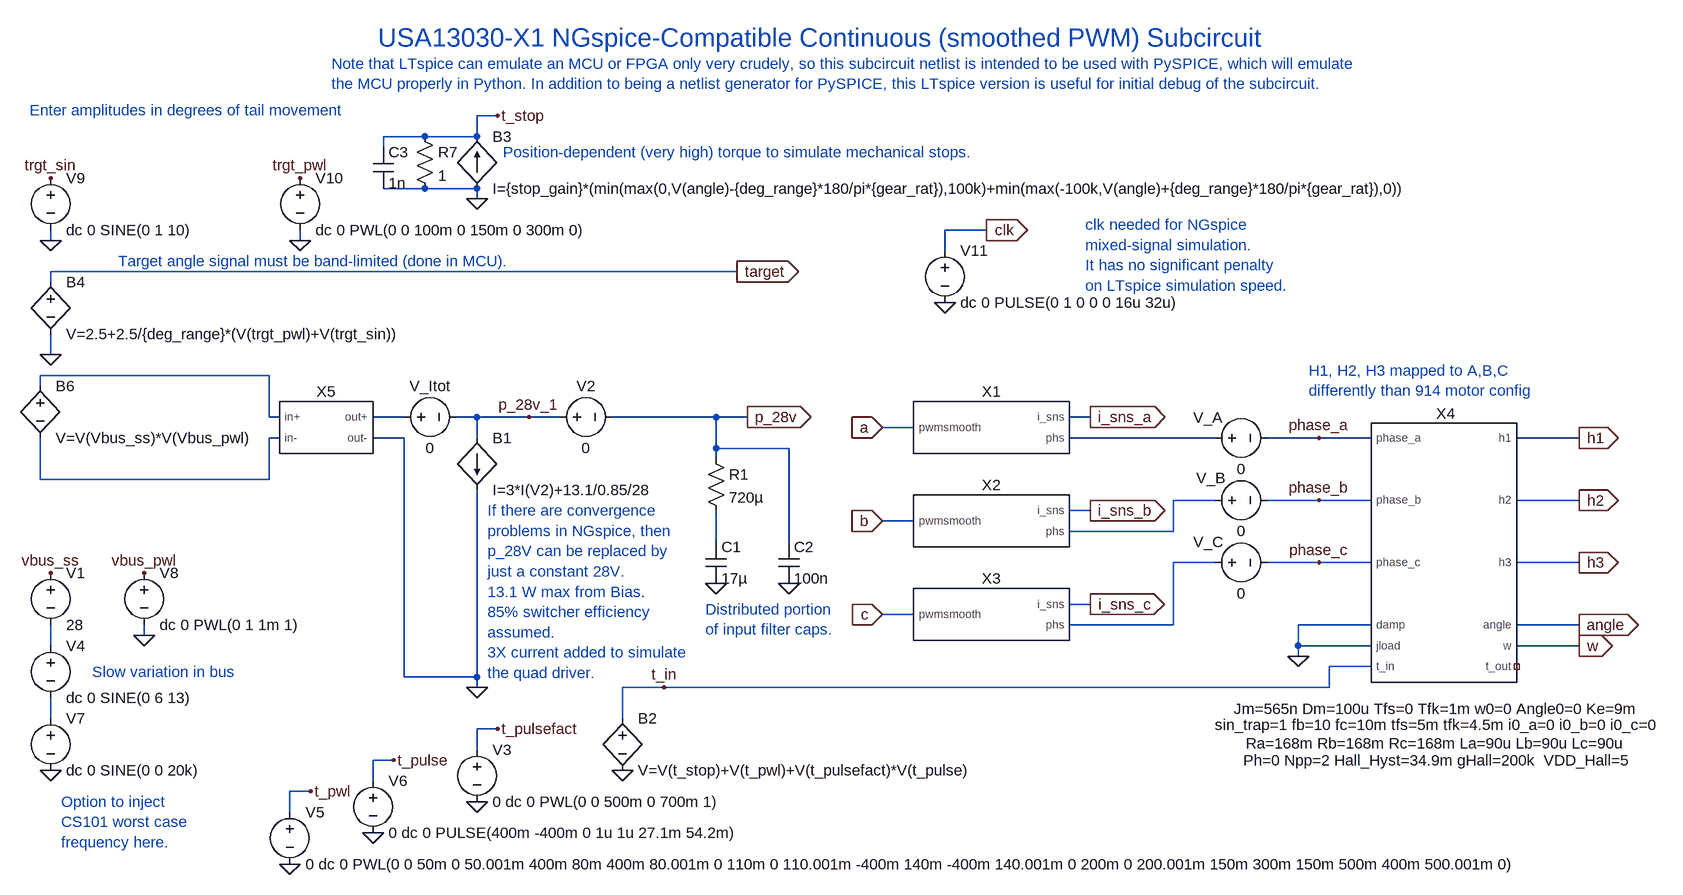
[diagram p0: schematic USA13030_X1_NG_cont.asc]
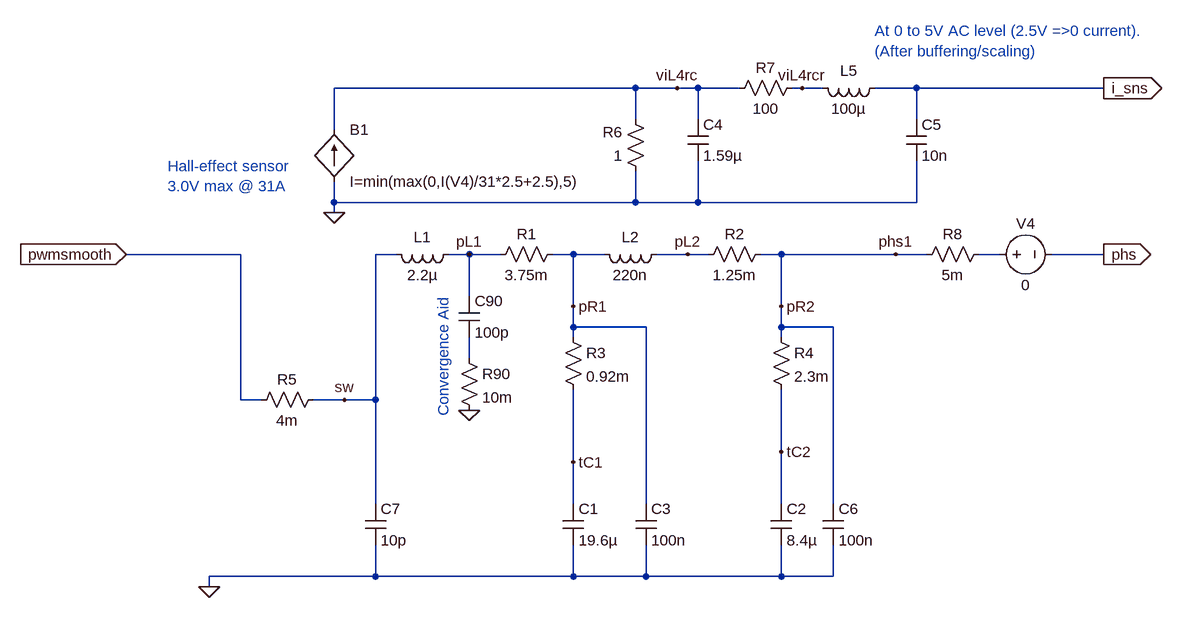
[diagram p1: sub-circuit usa13030_x1_ng_cont_out_fltr.asc]
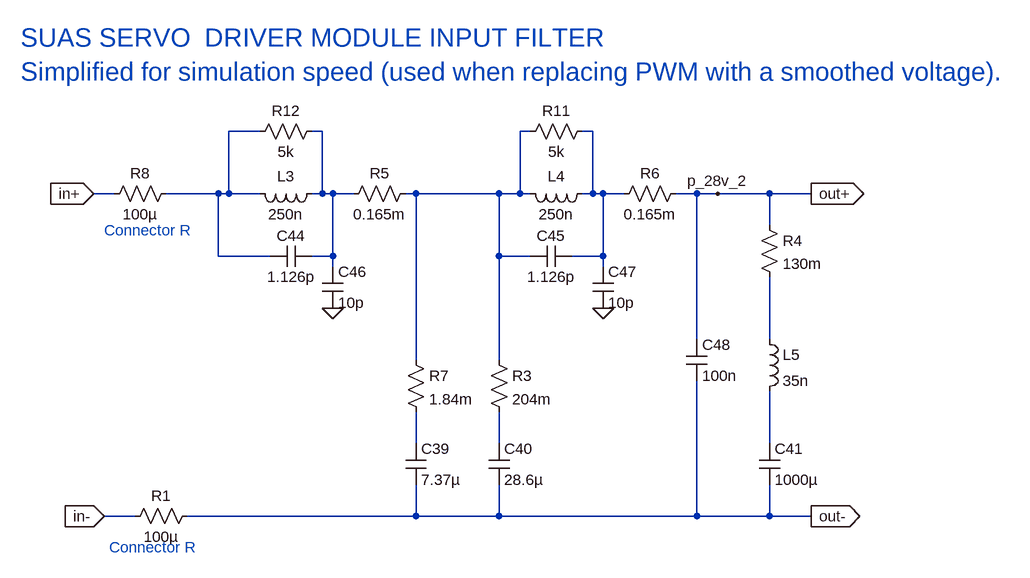
[diagram p2: sub-circuit usa13030_x1_ng_cont_in_fltr.asc]
USA13030_X1_NG_cont.asc, the LTspice schematic file:
Version 4
SHEET 1 3712 1104
WIRE -576 -288 -608 -288
WIRE -688 -256 -752 -256
WIRE -608 -256 -608 -288
WIRE -608 -256 -688 -256
WIRE -752 -240 -752 -256
WIRE -688 -176 -752 -176
WIRE -608 -176 -688 -176
WIRE -608 -160 -608 -176
WIRE 176 -112 112 -112
WIRE -1264 -96 -1264 -112
WIRE -880 -96 -880 -112
WIRE 112 -80 112 -112
WIRE -208 -48 -1264 -48
WIRE -1264 -32 -1264 -48
WIRE -1264 80 -1264 48
WIRE -928 112 -1280 112
WIRE -1280 128 -1280 112
WIRE -928 176 -928 112
WIRE -912 176 -928 176
WIRE -720 176 -768 176
WIRE -608 176 -640 176
WIRE -528 176 -608 176
WIRE -480 176 -528 176
WIRE -240 176 -400 176
WIRE -192 176 -240 176
WIRE 336 176 304 176
WIRE 64 192 16 192
WIRE -912 208 -928 208
WIRE -720 208 -768 208
WIRE -608 208 -608 176
WIRE 528 208 304 208
WIRE 688 208 608 208
WIRE 768 208 688 208
WIRE 1088 208 992 208
WIRE -240 224 -240 176
WIRE -128 224 -240 224
WIRE -240 240 -240 224
WIRE -1280 272 -1280 208
WIRE -928 272 -928 208
WIRE -928 272 -1280 272
WIRE 528 304 464 304
WIRE 688 304 608 304
WIRE 768 304 688 304
WIRE 1088 304 992 304
WIRE 336 320 304 320
WIRE 64 336 16 336
WIRE 464 352 464 304
WIRE 464 352 304 352
WIRE -240 368 -240 320
WIRE -128 368 -128 224
WIRE 528 400 464 400
WIRE 688 400 608 400
WIRE 768 400 688 400
WIRE 1088 400 992 400
WIRE 336 464 304 464
WIRE 64 480 16 480
WIRE 464 496 464 400
WIRE 464 496 304 496
WIRE 768 496 656 496
WIRE 1088 496 992 496
WIRE -1120 512 -1120 496
WIRE -1264 528 -1264 496
WIRE 656 528 656 496
WIRE 768 528 656 528
WIRE 1088 528 992 528
WIRE 656 544 656 528
WIRE 768 560 704 560
WIRE -720 576 -720 208
WIRE -608 576 -608 288
WIRE -608 576 -720 576
WIRE -608 592 -608 576
WIRE -320 592 -384 592
WIRE 704 592 704 560
WIRE 704 592 -320 592
WIRE -1264 640 -1264 608
WIRE -384 640 -384 592
WIRE -576 656 -608 656
WIRE -608 688 -608 656
WIRE -736 704 -768 704
WIRE -768 736 -768 704
WIRE -864 752 -896 752
WIRE -896 784 -896 752
FLAG -608 592 0
FLAG -1264 80 0
FLAG -384 720 0
FLAG -896 864 0
FLAG -864 752 t_pwl
FLAG -768 816 0
FLAG -736 704 t_pulse
FLAG -608 -160 0
FLAG -576 -288 t_stop
FLAG -1264 -96 0
FLAG -1264 -192 trgt_sin
FLAG -880 -96 0
FLAG -880 -192 trgt_pwl
FLAG -608 768 0
FLAG -576 656 t_pulsefact
FLAG 656 544 0
FLAG -320 592 t_in
FLAG 1088 496 angle
IOPIN 1088 496 Out
FLAG 1088 208 h1
IOPIN 1088 208 Out
FLAG 1088 304 h2
IOPIN 1088 304 Out
FLAG 16 192 a
IOPIN 16 192 In
FLAG 16 336 b
IOPIN 16 336 In
FLAG 16 480 c
IOPIN 16 480 In
FLAG -528 176 p_28v_1
FLAG 176 -112 clk
IOPIN 176 -112 Out
FLAG 112 0 0
FLAG -1264 416 vbus_ss
FLAG -1120 416 vbus_pwl
FLAG -1264 720 0
FLAG -1120 512 0
FLAG 1088 400 h3
IOPIN 1088 400 Out
FLAG 1088 528 w
IOPIN 1088 528 Out
FLAG 336 176 i_sns_a
IOPIN 336 176 Out
FLAG 336 320 i_sns_b
IOPIN 336 320 Out
FLAG 336 464 i_sns_c
IOPIN 336 464 Out
FLAG -192 176 p_28v
IOPIN -192 176 Out
FLAG -208 -48 target
IOPIN -208 -48 Out
FLAG 688 208 phase_a
FLAG 688 304 phase_b
FLAG 688 400 phase_c
FLAG -240 432 0
FLAG -128 432 0
SYMBOL voltage -496 176 R270
WINDOW 0 32 56 VTop 2
WINDOW 3 -32 56 VBottom 2
WINDOW 123 0 0 Left 2
WINDOW 39 0 0 Left 2
SYMATTR InstName V2
SYMATTR Value 0
SYMBOL bi -608 208 R0
SYMATTR InstName B1
SYMATTR Value I=3*I(V2)+13.1/0.85/28
SYMBOL bv -384 624 R0
SYMATTR InstName B2
SYMATTR Value V=V(t_stop)+V(t_pwl)+V(t_pulsefact)*V(t_pulse)
SYMBOL voltage -896 768 R0
WINDOW 123 0 0 Left 2
WINDOW 39 0 0 Left 2
SYMATTR InstName V5
SYMATTR Value 0 dc 0 PWL(0 0 50m 0 50.001m 400m 80m 400m 80.001m 0 110m 0 110.001m -400m 140m -400m 140.001m 0 200m 0 200.001m 150m 300m 150m 500m 400m 500.001m 0)
SYMBOL voltage -768 720 R0
WINDOW 123 0 0 Left 2
WINDOW 39 0 0 Left 2
SYMATTR InstName V6
SYMATTR Value 0 dc 0 PULSE(400m -400m 0 1u 1u 27.1m 54.2m)
SYMBOL bi -608 -176 M180
WINDOW 0 24 80 Left 2
WINDOW 3 24 0 Left 2
SYMATTR InstName B3
SYMATTR Value I={stop_gain}*(min(max(0,V(angle)-{deg_range}*180/pi*{gear_rat}),100k)+min(max(-100k,V(angle)+{deg_range}*180/pi*{gear_rat}),0))
SYMBOL res -704 -272 R0
SYMATTR InstName R7
SYMATTR Value 1
SYMBOL voltage -608 672 R0
WINDOW 123 0 0 Left 2
WINDOW 39 0 0 Left 2
SYMATTR InstName V3
SYMATTR Value 0 dc 0 PWL(0 0 500m 0 700m 1)
SYMBOL cap -768 -240 R0
SYMATTR InstName C3
SYMATTR Value 1n
SYMBOL voltage -736 176 R270
WINDOW 0 32 56 VTop 2
WINDOW 3 -32 56 VBottom 2
WINDOW 123 0 0 Left 2
WINDOW 39 0 0 Left 2
SYMATTR InstName V_Itot
SYMATTR Value 0
SYMBOL voltage 512 208 R270
WINDOW 0 16 5 VTop 2
WINDOW 3 -32 56 VBottom 2
WINDOW 123 0 0 Left 2
WINDOW 39 0 0 Left 2
SYMATTR InstName V_A
SYMATTR Value 0
SYMBOL voltage 512 304 R270
WINDOW 0 19 10 VTop 2
WINDOW 3 -32 56 VBottom 2
WINDOW 123 0 0 Left 2
WINDOW 39 0 0 Left 2
SYMATTR InstName V_B
SYMATTR Value 0
SYMBOL voltage 512 400 R270
WINDOW 0 16 6 VTop 2
WINDOW 3 -32 56 VBottom 2
WINDOW 123 0 0 Left 2
WINDOW 39 0 0 Left 2
SYMATTR InstName V_C
SYMATTR Value 0
SYMBOL voltage -1264 400 R0
WINDOW 123 0 0 Left 2
WINDOW 39 0 0 Left 2
SYMATTR InstName V1
SYMATTR Value 28
SYMBOL voltage -1264 512 R0
SYMATTR InstName V4
SYMATTR Value dc 0 SINE(0 6 13)
SYMBOL voltage -1264 624 R0
SYMATTR InstName V7
SYMATTR Value dc 0 SINE(0 0 20k)
SYMBOL voltage -1120 400 R0
WINDOW 123 0 0 Left 2
WINDOW 39 0 0 Left 2
SYMATTR InstName V8
SYMATTR Value dc 0 PWL(0 1 1m 1)
SYMBOL voltage -1264 -208 R0
SYMATTR InstName V9
SYMATTR Value dc 0 SINE(0 1 10)
SYMBOL voltage -880 -208 R0
SYMATTR InstName V10
SYMATTR Value dc 0 PWL(0 0 100m 0 150m 0 300m 0)
SYMBOL bv -1264 -48 R0
SYMATTR InstName B4
SYMATTR Value V=2.5+2.5/{deg_range}*(V(trgt_pwl)+V(trgt_sin))
SYMBOL bv -1280 112 R0
SYMATTR InstName B6
SYMATTR Value V=V(Vbus_ss)*V(Vbus_pwl)
SYMBOL voltage 112 -96 R0
SYMATTR InstName V11
SYMATTR Value dc 0 PULSE(0 1 0 0 0 16u 32u)
SYMBOL BLDC_SCD00914 880 480 R0
SYMATTR InstName X4
SYMBOL USA13030_X1_NG_cont_out_fltr 176 192 R0
SYMATTR InstName X1
SYMBOL USA13030_X1_NG_cont_out_fltr 176 336 R0
SYMATTR InstName X2
SYMBOL USA13030_X1_NG_cont_out_fltr 176 480 R0
SYMATTR InstName X3
SYMBOL USA13030_X1_NG_cont_in_fltr -848 192 R0
SYMATTR InstName X5
SYMBOL res -256 224 R0
SYMATTR InstName R1
SYMATTR Value 720µ
SYMBOL cap -256 368 R0
SYMATTR InstName C1
SYMATTR Value 17µ
SYMBOL cap -144 368 R0
SYMATTR InstName C2
SYMATTR Value 100n
TEXT 672 104 Left 2 ;H1, H2, H3 mapped to A,B,C \ndifferently than 914 motor config
TEXT -1248 768 Left 2 ;Option to inject\nCS101 worst case\nfrequency here.
TEXT -1200 568 Left 2 ;Slow variation in bus
TEXT -1296 -296 Left 2 ;Enter amplitudes in degrees of tail movement
TEXT -1160 -64 Left 2 ;Target angle signal must be band-limited (done in MCU).
TEXT -592 320 Left 2 ;If there are convergence\nproblems in NGspice, then\np_28V can be replaced by\njust a constant 28V. \n13.1 W max from Bias.\n85% switcher efficiency\nassumed.\n3X current added to simulate\nthe quad driver.
TEXT 328 -120 Left 2 ;clk needed for NGspice \nmixed-signal simulation. \nIt has no significant penalty \non LTspice simulation speed.
TEXT -760 -408 Left 4 ;USA13030-X1 NGspice-Compatible Continuous (smoothed PWM) Subcircuit
TEXT -568 -232 Left 2 ;Position-dependent (very high) torque to simulate mechanical stops.
TEXT -832 -368 Left 2 ;Note that LTspice can emulate an MCU or FPGA only very crudely, so this subcircuit netlist is intended to be used with PySPICE, which will emulate \nthe MCU properly in Python. In addition to being a netlist generator for PySPICE, this LTspice version is useful for initial debug of the subcircuit.
TEXT -256 472 Left 2 ;Distributed portion\nof input filter caps.

usa13030_x1_ng_cont_out_fltr.asc, the sub-circuit schematic file:
Version 4
SHEET 1 1092 680
WIRE 224 -336 -240 -336
WIRE 288 -336 224 -336
WIRE 320 -336 288 -336
WIRE 384 -336 320 -336
WIRE 480 -336 464 -336
WIRE 512 -336 480 -336
WIRE 656 -336 592 -336
WIRE 944 -336 656 -336
WIRE 224 -288 224 -336
WIRE 320 -288 320 -336
WIRE 656 -288 656 -336
WIRE -240 -272 -240 -336
WIRE -240 -160 -240 -192
WIRE 224 -160 224 -208
WIRE 224 -160 -240 -160
WIRE 320 -160 320 -224
WIRE 320 -160 224 -160
WIRE 656 -160 656 -224
WIRE 656 -160 320 -160
WIRE -240 -144 -240 -160
WIRE -384 -80 -560 -80
WIRE -144 -80 -176 -80
WIRE -32 -80 -64 -80
WIRE 16 -80 -32 -80
WIRE 128 -80 96 -80
WIRE 176 -80 128 -80
WIRE 304 -80 256 -80
WIRE 336 -80 304 -80
WIRE 448 -80 416 -80
WIRE 624 -80 448 -80
WIRE 672 -80 624 -80
WIRE 784 -80 752 -80
WIRE 944 -80 864 -80
WIRE -32 -16 -32 -80
WIRE 128 0 128 -80
WIRE 448 0 448 -80
WIRE 128 32 128 0
WIRE 240 32 128 32
WIRE 448 32 448 0
WIRE 528 32 448 32
WIRE 128 48 128 32
WIRE 448 48 448 32
WIRE -32 80 -32 48
WIRE -384 144 -384 -80
WIRE -352 144 -384 144
WIRE -224 144 -272 144
WIRE -176 144 -176 -80
WIRE -176 144 -224 144
WIRE 448 224 448 128
WIRE 128 240 128 128
WIRE -176 304 -176 144
WIRE 128 304 128 240
WIRE 240 304 240 32
WIRE 448 304 448 224
WIRE 528 304 528 32
WIRE -176 416 -176 368
WIRE -176 416 -432 416
WIRE 128 416 128 368
WIRE 128 416 -176 416
WIRE 240 416 240 368
WIRE 240 416 128 416
WIRE 448 416 448 368
WIRE 448 416 240 416
WIRE 528 416 528 368
WIRE 528 416 448 416
WIRE -432 432 -432 416
FLAG -432 432 0
FLAG -560 -80 pwmsmooth
IOPIN -560 -80 In
FLAG 944 -80 phs
IOPIN 944 -80 Out
FLAG -224 144 sw
FLAG -32 -80 pL1
FLAG 128 0 pR1
FLAG 128 240 tC1
FLAG 448 224 tC2
FLAG 448 0 pR2
FLAG 304 -80 pL2
FLAG -240 -144 0
FLAG 288 -336 viL4rc
FLAG 480 -336 viL4rcr
FLAG 944 -336 i_sns
IOPIN 944 -336 Out
FLAG 624 -80 phs1
FLAG -32 160 0
SYMBOL ind -48 -96 R90
WINDOW 0 5 56 VBottom 2
WINDOW 3 32 56 VTop 2
WINDOW 39 60 56 VTop 2
SYMATTR InstName L1
SYMATTR Value 2.2µ
SYMBOL ind 272 -96 R90
WINDOW 0 5 56 VBottom 2
WINDOW 3 32 56 VTop 2
WINDOW 39 60 56 VTop 2
SYMATTR InstName L2
SYMATTR Value 220n
SYMBOL cap 112 304 R0
WINDOW 39 24 36 Left 2
SYMATTR InstName C1
SYMATTR Value 19.6µ
SYMBOL cap 432 304 R0
WINDOW 39 24 36 Left 2
SYMATTR InstName C2
SYMATTR Value 8.4µ
SYMBOL res 112 -96 R90
WINDOW 0 0 56 VBottom 2
WINDOW 3 32 56 VTop 2
SYMATTR InstName R1
SYMATTR Value 3.75m
SYMBOL res 432 -96 R90
WINDOW 0 0 56 VBottom 2
WINDOW 3 32 56 VTop 2
SYMATTR InstName R2
SYMATTR Value 1.25m
SYMBOL res 112 32 R0
SYMATTR InstName R3
SYMATTR Value 0.92m
SYMBOL res 432 32 R0
SYMATTR InstName R4
SYMATTR Value 2.3m
SYMBOL res 240 -192 R180
WINDOW 0 36 76 Left 2
WINDOW 3 36 40 Left 2
SYMATTR InstName R6
SYMATTR Value 1
SYMBOL cap 304 -288 R0
SYMATTR InstName C4
SYMATTR Value 1.59µ
SYMBOL res 480 -352 R90
WINDOW 0 0 56 VBottom 2
WINDOW 3 32 56 VTop 2
SYMATTR InstName R7
SYMATTR Value 100
SYMBOL ind 608 -352 R90
WINDOW 0 5 56 VBottom 2
WINDOW 3 32 56 VTop 2
WINDOW 39 60 56 VTop 2
SYMATTR InstName L5
SYMATTR Value 100µ
SYMBOL cap 640 -288 R0
SYMATTR InstName C5
SYMATTR Value 10n
SYMBOL res -256 128 R90
WINDOW 0 0 56 VBottom 2
WINDOW 3 32 56 VTop 2
SYMATTR InstName R5
SYMATTR Value 4m
SYMBOL bi -240 -192 M180
WINDOW 0 24 80 Left 2
WINDOW 3 24 0 Left 2
SYMATTR InstName B1
SYMATTR Value I=min(max(0,I(V4)/31*2.5+2.5),5)
SYMBOL voltage 768 -80 R270
WINDOW 0 32 56 VTop 2
WINDOW 3 -32 56 VBottom 2
WINDOW 123 0 0 Left 2
WINDOW 39 0 0 Left 2
SYMATTR InstName V4
SYMATTR Value 0
SYMBOL cap 224 304 R0
WINDOW 39 24 36 Left 2
SYMATTR InstName C3
SYMATTR Value 100n
SYMBOL cap 512 304 R0
WINDOW 39 24 36 Left 2
SYMATTR InstName C6
SYMATTR Value 100n
SYMBOL cap -192 304 R0
WINDOW 39 24 36 Left 2
SYMATTR InstName C7
SYMATTR Value 10p
SYMBOL res 768 -96 R90
WINDOW 0 0 56 VBottom 2
WINDOW 3 32 56 VTop 2
SYMATTR InstName R8
SYMATTR Value 5m
SYMBOL cap -48 -16 R0
SYMATTR InstName C90
SYMATTR Value 100p
SYMBOL res -48 64 R0
SYMATTR InstName R90
SYMATTR Value 10m
TEXT 592 -424 Left 2 ;At 0 to 5V AC level (2.5V =>0 current).\n(After buffering/scaling)
TEXT -496 -216 Left 2 ;Hall-effect sensor\n3.0V max @ 31A
TEXT -72 -16 VRight 2 ;Convergence Aid

usa13030_x1_ng_cont_in_fltr.asc, the sub-circuit schematic file:
Version 4
SHEET 1 2412 680
WIRE -496 -1104 -544 -1104
WIRE -400 -1104 -416 -1104
WIRE -80 -1104 -96 -1104
WIRE 16 -1104 0 -1104
WIRE -720 -1008 -752 -1008
WIRE -560 -1008 -640 -1008
WIRE -544 -1008 -544 -1104
WIRE -544 -1008 -560 -1008
WIRE -496 -1008 -544 -1008
WIRE -400 -1008 -400 -1104
WIRE -400 -1008 -416 -1008
WIRE -384 -1008 -400 -1008
WIRE -352 -1008 -384 -1008
WIRE -256 -1008 -272 -1008
WIRE -128 -1008 -256 -1008
WIRE -96 -1008 -96 -1104
WIRE -96 -1008 -128 -1008
WIRE -80 -1008 -96 -1008
WIRE 16 -1008 16 -1104
WIRE 16 -1008 0 -1008
WIRE 32 -1008 16 -1008
WIRE 64 -1008 32 -1008
WIRE 176 -1008 144 -1008
WIRE 208 -1008 176 -1008
WIRE 288 -1008 208 -1008
WIRE 352 -1008 288 -1008
WIRE 288 -960 288 -1008
WIRE -560 -912 -560 -1008
WIRE -480 -912 -560 -912
WIRE -384 -912 -384 -1008
WIRE -384 -912 -416 -912
WIRE -128 -912 -128 -1008
WIRE -80 -912 -128 -912
WIRE 32 -912 32 -1008
WIRE 32 -912 -16 -912
WIRE -384 -896 -384 -912
WIRE 32 -896 32 -912
WIRE 176 -784 176 -1008
WIRE 288 -784 288 -880
WIRE -256 -752 -256 -1008
WIRE -128 -752 -128 -912
WIRE -256 -624 -256 -672
WIRE -128 -624 -128 -672
WIRE 288 -624 288 -704
WIRE -688 -512 -736 -512
WIRE -256 -512 -256 -560
WIRE -256 -512 -608 -512
WIRE -128 -512 -128 -560
WIRE -128 -512 -256 -512
WIRE 176 -512 176 -720
WIRE 176 -512 -128 -512
WIRE 288 -512 288 -560
WIRE 288 -512 176 -512
WIRE 352 -512 288 -512
FLAG -752 -1008 in+
IOPIN -752 -1008 In
FLAG 352 -1008 out+
IOPIN 352 -1008 Out
FLAG -736 -512 in-
IOPIN -736 -512 In
FLAG 352 -512 out-
IOPIN 352 -512 Out
FLAG -384 -832 0
FLAG 32 -832 0
FLAG 208 -1008 p_28v_2
SYMBOL ind -400 -1024 R90
WINDOW 0 5 56 VBottom 2
WINDOW 3 32 56 VTop 2
WINDOW 39 60 56 VTop 2
SYMATTR InstName L3
SYMATTR Value 250n
SYMBOL ind 16 -1024 R90
WINDOW 0 5 56 VBottom 2
WINDOW 3 32 56 VTop 2
WINDOW 39 60 56 VTop 2
SYMATTR InstName L4
SYMATTR Value 250n
SYMBOL cap -272 -624 R0
WINDOW 39 24 36 Left 2
SYMATTR InstName C39
SYMATTR Value 7.37µ
SYMBOL cap -144 -624 R0
WINDOW 39 24 36 Left 2
SYMATTR InstName C40
SYMATTR Value 28.6µ
SYMBOL cap 272 -624 R0
WINDOW 39 24 36 Left 2
SYMATTR InstName C41
SYMATTR Value 1000µ
SYMBOL res -144 -768 R0
SYMATTR InstName R3
SYMATTR Value 204m
SYMBOL res 272 -976 R0
SYMATTR InstName R4
SYMATTR Value 130m
SYMBOL ind 272 -800 R0
SYMATTR InstName L5
SYMATTR Value 35n
SYMBOL res -256 -1024 R90
WINDOW 0 0 56 VBottom 2
WINDOW 3 32 56 VTop 2
SYMATTR InstName R5
SYMATTR Value 0.165m
SYMBOL res 160 -1024 R90
WINDOW 0 0 56 VBottom 2
WINDOW 3 32 56 VTop 2
SYMATTR InstName R6
SYMATTR Value 0.165m
SYMBOL res -272 -768 R0
SYMATTR InstName R7
SYMATTR Value 1.84m
SYMBOL res 16 -1120 R90
WINDOW 0 0 56 VBottom 2
WINDOW 3 32 56 VTop 2
SYMATTR InstName R11
SYMATTR Value 5k
SYMBOL res -400 -1120 R90
WINDOW 0 0 56 VBottom 2
WINDOW 3 32 56 VTop 2
SYMATTR InstName R12
SYMATTR Value 5k
SYMBOL cap -416 -928 R90
WINDOW 0 0 32 VBottom 2
WINDOW 3 32 32 VTop 2
SYMATTR InstName C44
SYMATTR Value 1.126p
SYMBOL cap -16 -928 R90
WINDOW 0 0 32 VBottom 2
WINDOW 3 32 32 VTop 2
SYMATTR InstName C45
SYMATTR Value 1.126p
SYMBOL cap -400 -896 R0
SYMATTR InstName C46
SYMATTR Value 10p
SYMBOL cap 16 -896 R0
SYMATTR InstName C47
SYMATTR Value 10p
SYMBOL cap 160 -784 R0
SYMATTR InstName C48
SYMATTR Value 100n
SYMBOL res -624 -1024 R90
WINDOW 0 0 56 VBottom 2
WINDOW 3 32 56 VTop 2
SYMATTR InstName R8
SYMATTR Value 100µ
SYMBOL res -592 -528 R90
WINDOW 0 0 56 VBottom 2
WINDOW 3 32 56 VTop 2
SYMATTR InstName R1
SYMATTR Value 100µ
TEXT -864 -1248 Left 4 ;SUAS SERVO  DRIVER MODULE INPUT FILTER\nSimplified for simulation speed (used when replacing PWM with a smoothed voltage).
TEXT -736 -952 Left 2 ;Connector R
TEXT -728 -464 Left 2 ;Connector R

The netlist it stands for:
* USA13030_X1_NG_cont.asc
V2 p_28v_1 p_28v 0
B1 p_28v_1 0 I=3*I(V2)+13.1/0.85/28
B2 t_in 0 V=V(t_stop)+V(t_pwl)+V(t_pulsefact)*V(t_pulse)
V5 t_pwl 0 0 dc 0 PWL(0 0 50m 0 50.001m 400m 80m 400m 80.001m 0 110m 0 110.001m -400m 140m -400m 140.001m 0 200m 0 200.001m 150m 300m 150m 500m 400m 500.001m 0)
V6 t_pulse 0 0 dc 0 PULSE(400m -400m 0 1u 1u 27.1m 54.2m)
B3 0 t_stop I={stop_gain}*(min(max(0,V(angle)-{deg_range}*180/pi*{gear_rat}),100k)+min(max(-100k,V(angle)+{deg_range}*180/pi*{gear_rat}),0))
R7 t_stop 0 1
V3 t_pulsefact 0 0 dc 0 PWL(0 0 500m 0 700m 1)
C3 t_stop 0 1n
V_Itot N002 p_28v_1 0
V_A N004 phase_a 0
V_B N005 phase_b 0
V_C N007 phase_c 0
V1 vbus_ss N008 28
V4 N008 N009 dc 0 SINE(0 6 13)
V7 N009 0 dc 0 SINE(0 0 20k)
V8 vbus_pwl 0 dc 0 PWL(0 1 1m 1)
V9 trgt_sin 0 dc 0 SINE(0 1 10)
V10 trgt_pwl 0 dc 0 PWL(0 0 100m 0 150m 0 300m 0)
B4 target 0 V=2.5+2.5/{deg_range}*(V(trgt_pwl)+V(trgt_sin))
B6 N001 N003 V=V(Vbus_ss)*V(Vbus_pwl)
V11 clk 0 dc 0 PULSE(0 1 0 0 0 16u 32u)
XX4 0 0 phase_a phase_b phase_c t_in angle h1 h2 h3 NC_01 w BLDC_SCD00914 params: Jm=565n Dm=100u Tfs=0 Tfk=1m w0=0 Angle0=0 Ke=9m sin_trap=1 fb=10 fc=10m tfs=5m tfk=4.5m i0_a=0 i0_b=0 i0_c=0 Ra=168m Rb=168m Rc=168m La=90u Lb=90u Lc=90u Ph=0 Npp=2 Hall_Hyst=34.9m gHall=200k  VDD_Hall=5  ; pins damp jload phase_a phase_b phase_c t_in angle h1 h2 h3 t_out w
XX1 a i_sns_a N004 usa13030_x1_ng_cont_out_fltr
XX2 b i_sns_b N005 usa13030_x1_ng_cont_out_fltr
XX3 c i_sns_c N007 usa13030_x1_ng_cont_out_fltr
XX5 N001 N003 N002 0 usa13030_x1_ng_cont_in_fltr
R1 p_28v N006 720µ
C1 N006 0 17µ
C2 p_28v 0 100n

* block symbol definitions
.subckt usa13030_x1_ng_cont_out_fltr pwmsmooth i_sns phs
L1 pL1 sw 2.2µ
L2 pL2 pR1 220n
C1 tC1 0 19.6µ
C2 tC2 0 8.4µ
R1 pR1 pL1 3.75m
R2 phs1 pL2 1.25m
R3 pR1 tC1 0.92m
R4 phs1 tC2 2.3m
R6 0 viL4rc 1
C4 viL4rc 0 1.59µ
R7 viL4rcr viL4rc 100
L5 i_sns viL4rcr 100µ
C5 i_sns 0 10n
R5 sw pwmsmooth 4m
B1 0 viL4rc I=min(max(0,I(V4)/31*2.5+2.5),5)
V4 N001 phs 0
C3 pR1 0 100n
C6 phs1 0 100n
C7 sw 0 10p
R8 N001 phs1 5m
C90 pL1 N002 100p
R90 N002 0 10m
* At 0 to 5V AC level (2.5V =>0 current).
* (After buffering/scaling)
* Hall-effect sensor
* 3.0V max @ 31A
* Convergence Aid
.ends usa13030_x1_ng_cont_out_fltr

.subckt usa13030_x1_ng_cont_in_fltr in+ in- out+ out-
L3 N002 N001 250n
L4 N004 N003 250n
C39 N006 out- 7.37µ
C40 N007 out- 28.6µ
C41 N008 out- 1000µ
R3 N003 N007 204m
R4 out+ N005 130m
L5 N005 N008 35n
R5 N003 N002 0.165m
R6 out+ N004 0.165m
R7 N003 N006 1.84m
R11 N004 N003 5k
R12 N002 N001 5k
C44 N002 N001 1.126p
C45 N004 N003 1.126p
C46 N002 0 10p
C47 N004 0 10p
C48 out+ out- 100n
R8 N001 in+ 100µ
R1 out- in- 100µ
* SUAS SERVO  DRIVER MODULE INPUT FILTER
* Simplified for simulation speed (used when replacing PWM with a smoothed voltage).
* Connector R
* Connector R
.ends usa13030_x1_ng_cont_in_fltr

* H1, H2, H3 mapped to A,B,C
* differently than 914 motor config
* Option to inject
* CS101 worst case
* frequency here.
* Slow variation in bus
* Enter amplitudes in degrees of tail movement
* Target angle signal must be band-limited (done in MCU).
* If there are convergence
* problems in NGspice, then
* p_28V can be replaced by
* just a constant 28V.
* 13.1 W max from Bias.
* 85% switcher efficiency
* assumed.
* 3X current added to simulate
* the quad driver.
* clk needed for NGspice
* mixed-signal simulation.
* It has no significant penalty
* on LTspice simulation speed.
* USA13030-X1 NGspice-Compatible Continuous (smoothed PWM) Subcircuit
* Position-dependent (very high) torque to simulate mechanical stops.
* Note that LTspice can emulate an MCU or FPGA only very crudely, so this subcircuit netlist is intended to be used with PySPICE, which will emulate
* the MCU properly in Python. In addition to being a netlist generator for PySPICE, this LTspice version is useful for initial debug of the subcircuit.
* Distributed portion
* of input filter caps.
.backanno
.end